# EAGLE schematic RS232_2xNPN_FTDI (EAGLE 7.7.0)
RS232 Adapter using two NPN Transistors
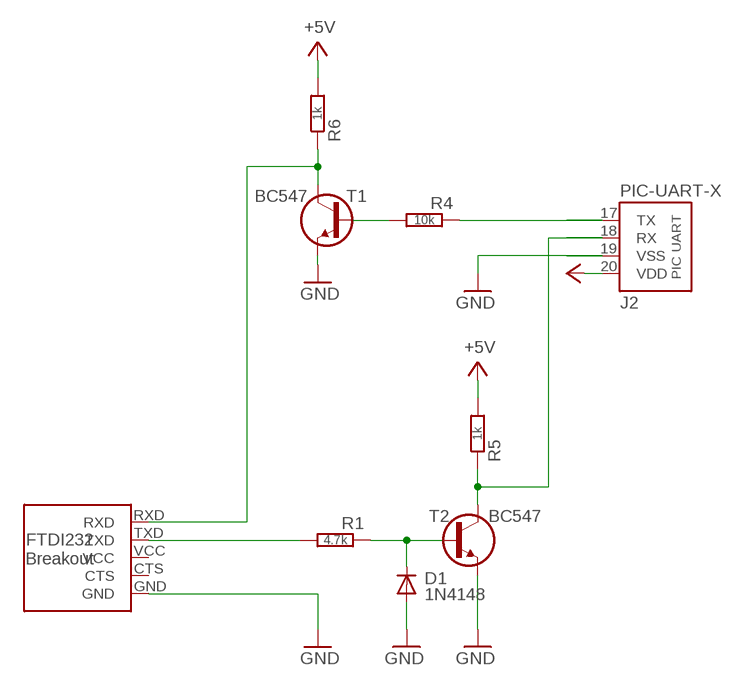
[diagram p0: schematic, sheet 1]

## Parts
D1  1N4148  1N414834-5V  [DO34-5V]
J1  FTDI232-BO-5P-L  [FTDI232-BO-5-L]
J2  PIC-UART-X  [PIC-UART-X]
R1  4.7k  R0202/7  [0202/7]
R4  10k  R0202/7  [0202/7]
R5  1k  R0202/7-V  [0202/7-V]
R6  1k  R0202/7-V  [0202/7-V]
T1  BC547  BC547CBE  [TO92-CBE]
T2  BC547  BC547CBE  [TO92-CBE]

## Nets
+5V: J2.20(VDD) R5.2 R6.2
GND: D1.A J1.GND J2.19(VSS) T1.E T2.E
N$1: J2.18(RX) R5.1 T2.C
N$2: D1.C R1.1 T2.B
N$3: J1.TXD R1.2
N$4: J2.17(TX) R4.1
N$5: R4.2 T1.B
N$9: J1.RXD R6.1 T1.C
Unconnected: J1.CTS J1.VCC

## Library data of the parts
D1 = d:1N4148
J1 = pinconn:FTDI232-BO-5P
J2 = pinconn:PIC-UART
R1 R4-R6 = r:R: RESISTOR, European symbol
T1 T2 = t:BC547

## Net classes
0 default: width 0.813 mm